# EAGLE design Photodiode_assembly_v1.1 (EAGLE 7.2.0)
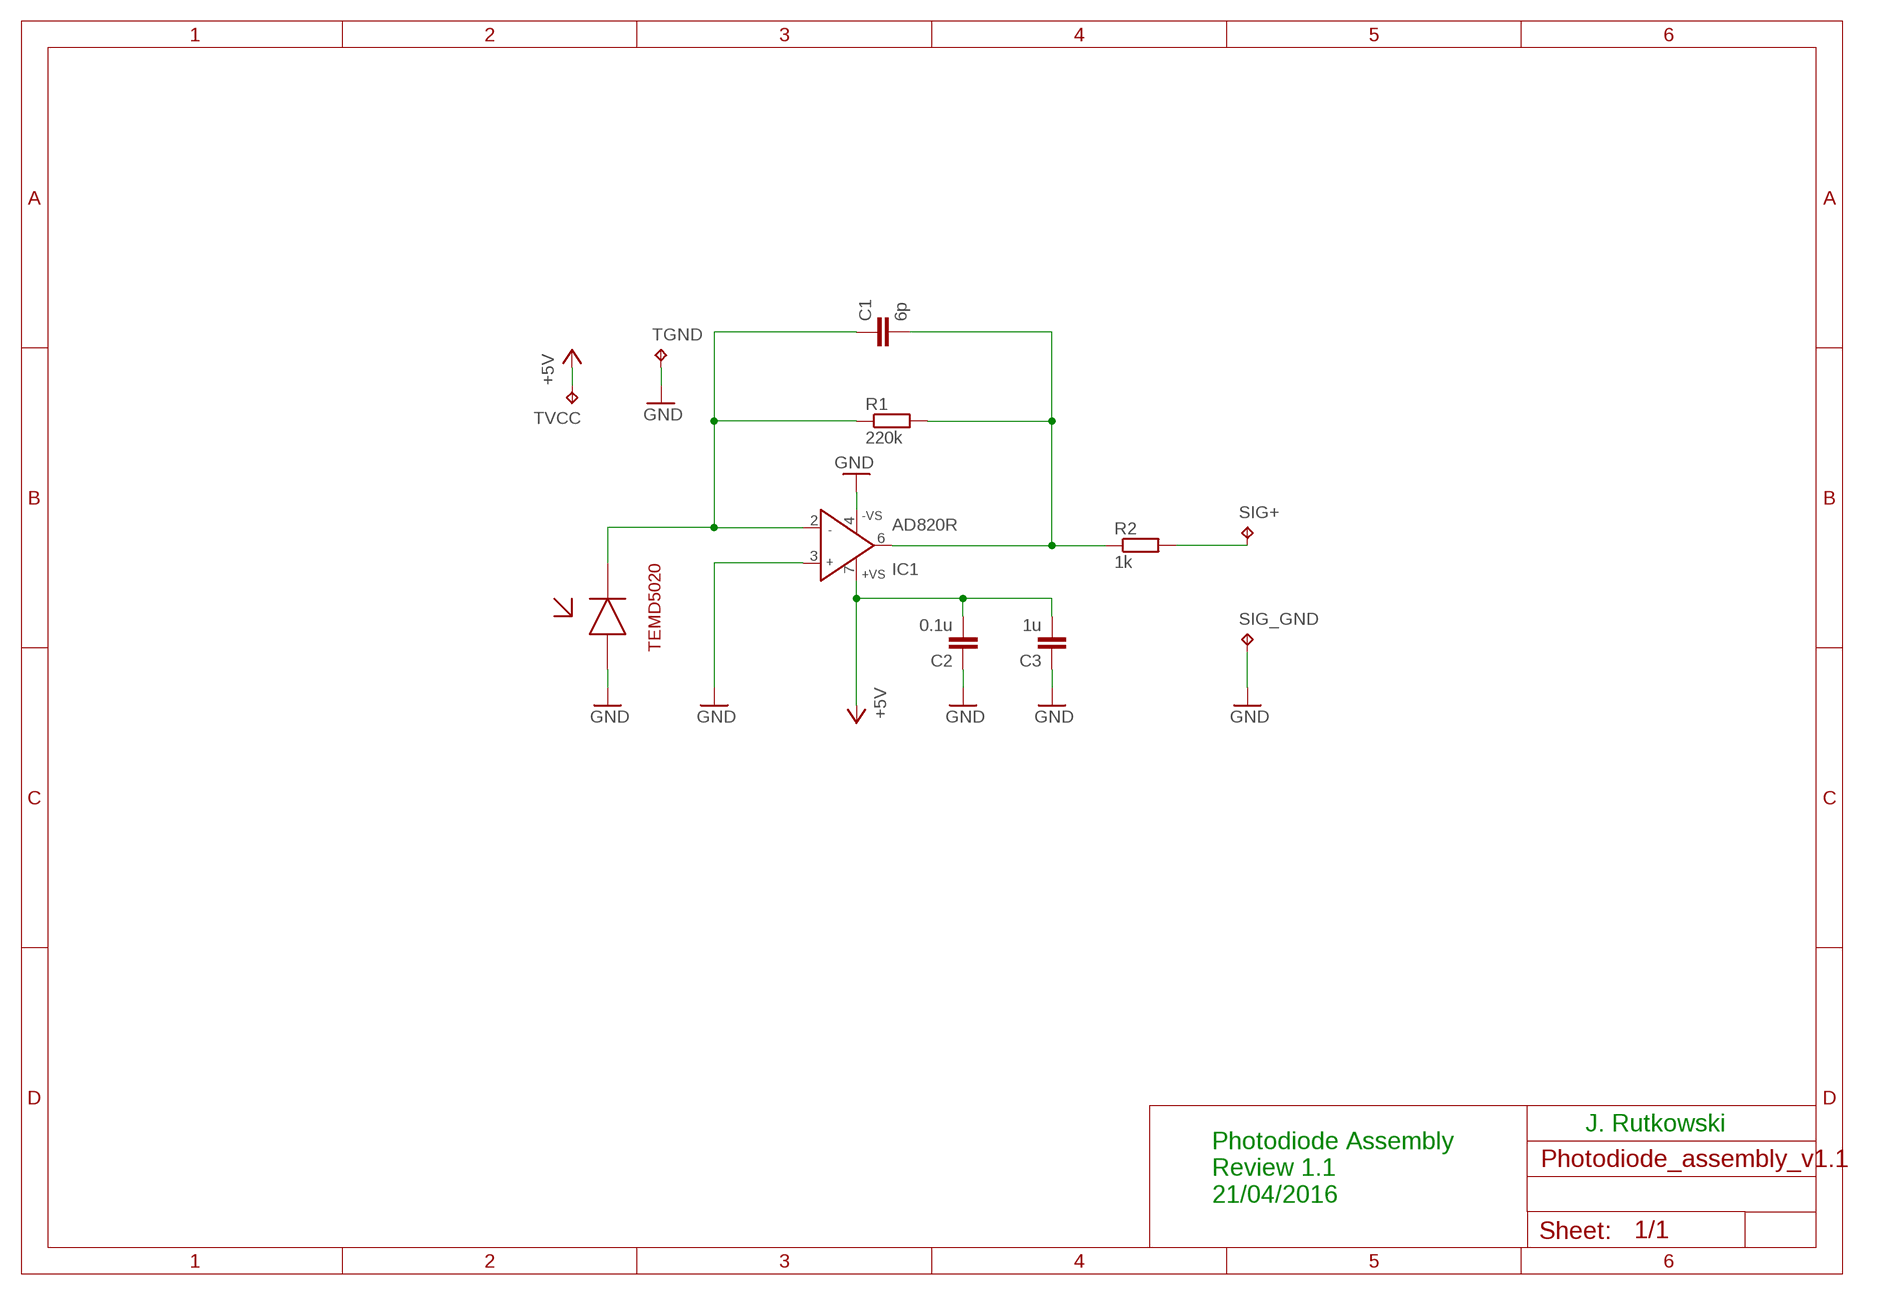
[diagram p0: schematic, sheet 1]

## Parts
C1  6p  C-EUC0805K  [C0805K]
C2  0.1u  C-EUC0805K  [C0805K]
C3  1u  C-EUC0805K  [C0805K]
D1  TEMD5020  [TEMD5020_OUTLINE]
IC1  AD820R  [SO8]
R1  220k  R-EU_R0805  [R0805]
R2  1k  R-EU_R0805  [R0805]
SIG+  TPPAD1-13Y  [P1-13Y]
SIG_GND  TPPAD1-13Y  [P1-13Y]
TGND  TPPAD1-13Y  [P1-13Y]
TVCC  TPPAD1-13Y  [P1-13Y]

## Nets
+5V: C2.2 C3.2 IC1.7(+VS) TVCC.TP
GND: C2.1 C3.1 D1.ANODE_BRD(ANODE_SYM) IC1.3(IN+) IC1.4(-VS) SIG_GND.TP TGND.TP
N$1: C1.1 D1.CATHODE_BRD(CATHODE) IC1.2(IN-) R1.1
N$2: C1.2 IC1.6(OUT) R1.2 R2.1
N$3: R2.2 SIG+.TP

## Notes on the sheet
- J. Rutkowski
- Photodiode Assembly
  Review 1.1
  21/04/2016

## Library data of the parts
C1-C3 = rcl:C-EU: CAPACITOR, European symbol
D1 = Photodiodes:TEMD5020
IC1 = analog-devices:AD820: Single-Supply, Rail-to-Rail, Low Power, FET Input Op Amp Source: http://www.analog.com/static/imported-files/data_sheets/AD820.pdf; OC_FARNELL: 1838867; OC_NEWARK: unknown
R1 R2 = rcl:R-EU_: RESISTOR, European symbol
SIG+ SIG_GND TGND TVCC = testpad:TP: Test pad

## Board
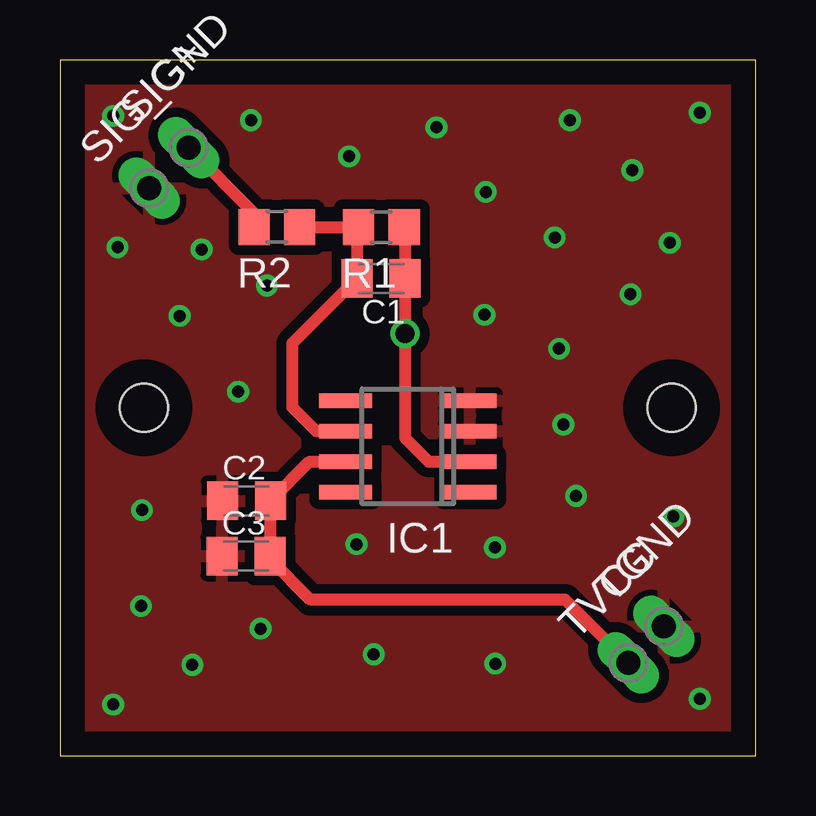
[diagram p1: board, top side]
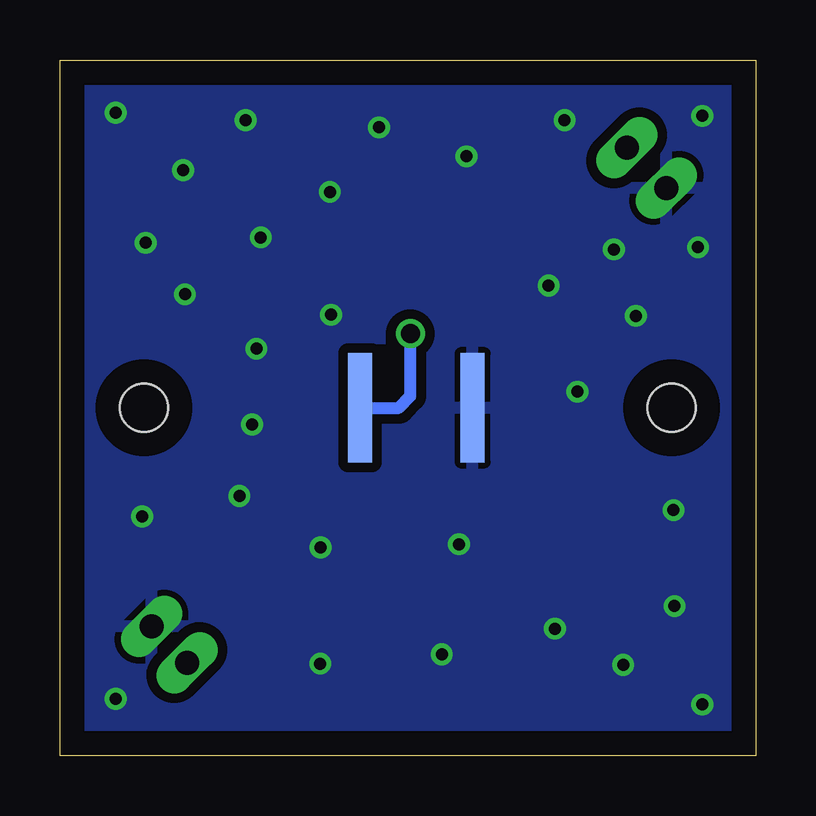
[diagram p2: board, bottom side, seen from below]

Size 29 x 29 mm. Coordinates in mm from the lower left corner, seen from the top.
Outline: 0,0 29,0 29,29 0,29 0,0
Copper layers (1*16): Top 0.035mm / dielectric 1.5mm / Bottom 0.035mm
Design rules "default": minimum track width 10mil, minimum drill 24mil, track to track 8mil, track to pad 8mil, pad to pad 8mil, via to via 8mil, smd to smd 8mil, copper to edge 40mil, drill to drill 8mil, minimum pad ring 10mil, minimum via ring 8mil, stop-mask expansion 4mil, vias tented up to drill 0mil, thermal gap 10mil
Holes 2 mm at 3.5,14.5 25.5,14.5

### Footprints (pad centres in the part's own frame; a part is rotated, then mirrored left to right if it is on the bottom)
C0805K = smd 1.3 x 1.6: 1 -1,0; 2 1,0
TEMD5020_OUTLINE = smd 1 x 4.55: ANODE_BRD -2.35,0; CATHODE_BRD 2.35,0
SO8 = smd 0.6 x 2.2: 1 -1.905,-2.6; 2 -0.635,-2.6; 3 0.635,-2.6; 4 1.905,-2.6; 5 1.905,2.6; 6 0.635,2.6; 7 -0.635,2.6; 8 -1.905,2.6
R0805 = smd 1.3 x 1.5: 1 -0.95,0; 2 0.95,0
P1-13Y = drill 1 pad 1.422 long: TP 0,0

### Placement (x,y rotation side)
C1  13.39,19.89 180 top
C2  7.78,10.62 0 top
C3  7.76,8.32 0 top
D1  14.15,14.5 180 bottom
IC1  14.5,12.89 90 top
R1  13.4,22.03 180 top
R2  9.04,22.04 180 top
SIG+  5.37,25.34 45 top
SIG_GND  3.72,23.66 45 top
TGND  25.18,5.38 45 top
TVCC  23.7,3.87 45 top

### Tracks (layer width: path | path; a pad name or v marks a point on that pad's centre or on a via)
+5V
  Top 0.5: TVCC.TP 21.07,6.5 10.45,6.5 8.76,8.19 C3.2 8.78,8.34 C2.2 10.41,12.26 IC1.7
GND  (via drill 0.5)
  other vias: 23.86,24.41 2.4,21.19 4.99,18.33 7.43,15.17 7.96,26.49 12.05,24.98 15.7,26.19 21.26,26.49 20.63,21.6 25.43,21.38 17.75,23.5 23.79,19.23 17.7,18.38 20.81,16.96 21.52,10.82 25.57,9.97 18.14,8.68 18.15,3.83 13.08,4.22 8.36,5.29 3.42,10.23 3.38,6.23 5.52,3.78 5.91,21.1 8.63,19.59 20.99,13.8 26.68,2.36 26.68,26.8 12.36,8.81 2.22,2.13 2.22,26.67
  pour Top (isolate 0.406): 0.5,28.5 28.5,28.5 28.5,0.5 0.5,0.5
  pour Bottom (isolate 0.406): 0.5,28.5 28.5,28.5 28.5,0.5 0.5,0.5
N$1  (via drill 0.8 pad 1.02)
  Top 0.5: IC1.2 15.37,12.26 14.39,13.24 v14.39,17.59 C1.1 14.39,21.99 R1.1
  Bottom 0.5: D1.CATHODE_BRD 14.87,14.5 14.39,14.98 v14.39,17.59
N$2
  Top 0.5: R2.1 R1.2 12.39,21.97 C1.2 9.68,17.18 9.68,14.53 10.69,13.53 IC1.6
N$3
  Top 0.5: SIG+.TP 8.09,22.6 R2.2

### Text on the board
Top_Legend: SIG+ | R2 | R1 | SIG / GND | C1 | C2 | IC1 | TGND | C3 | FEMTO-ST / MAC v1.1 | TVCC
Bottom_Legend: SIG+ | SIG / GND | D1 | TGND | FEMTO-ST / MAC v1.1 | TVCC